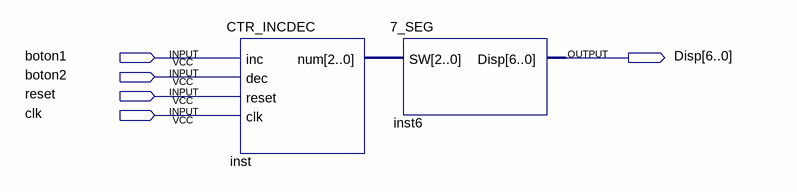
[diagram p0: schematic sheet]
// Quartus schematic TAREA2_D.bdf as structural Verilog: 2 symbols, 5 pins
module TAREA2_D (
  input  boton1,
  input  boton2,
  input  reset,
  input  clk,
  output [6:0] Disp
);

  wire [2:0] inst_num;

  CTR_INCDEC inst (.inc(boton1), .dec(boton2), .reset(reset), .clk(clk), .num(inst_num));
  \7_SEG  inst6 (.SW(inst_num), .Disp(Disp));
endmodule
